# Altium schematic sheet Skema IO.SchDoc
size A4
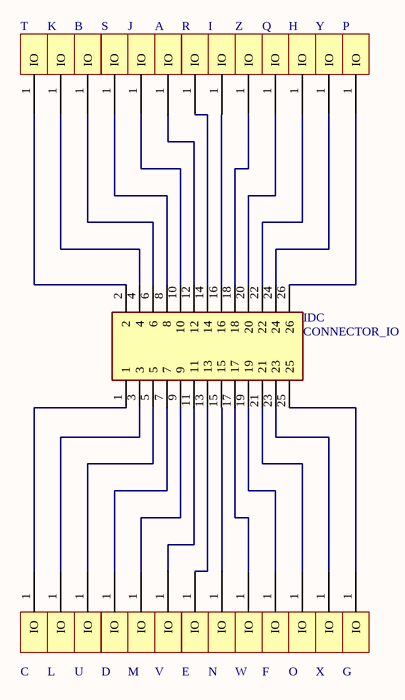
[diagram p0: Skema IO.SchDoc]

## Parts
A  Female_Connector_Banana  [F_Banana]  (value not drawn)
B  Female_Connector_Banana  [F_Banana]  (value not drawn)
C  Female_Connector_Banana  [F_Banana]  (value not drawn)
D  Female_Connector_Banana  [F_Banana]  (value not drawn)
E  Female_Connector_Banana  [F_Banana]  (value not drawn)
F  Female_Connector_Banana  [F_Banana]  (value not drawn)
G  Female_Connector_Banana  [F_Banana]  (value not drawn)
H  Female_Connector_Banana  [F_Banana]  (value not drawn)
I  Female_Connector_Banana  [F_Banana]  (value not drawn)
IDC  CONNECTOR_IO  [SHDRRA26W62P254_2X13_4023X957X920P]
J  Female_Connector_Banana  [F_Banana]  (value not drawn)
K  Female_Connector_Banana  [F_Banana]  (value not drawn)
L  Female_Connector_Banana  [F_Banana]  (value not drawn)
M  Female_Connector_Banana  [F_Banana]  (value not drawn)
N  Female_Connector_Banana  [F_Banana]  (value not drawn)
O  Female_Connector_Banana  [F_Banana]  (value not drawn)
P  Female_Connector_Banana  [F_Banana]  (value not drawn)
Q  Female_Connector_Banana  [F_Banana]  (value not drawn)
R  Female_Connector_Banana  [F_Banana]  (value not drawn)
S  Female_Connector_Banana  [F_Banana]  (value not drawn)
T  Female_Connector_Banana  [F_Banana]  (value not drawn)
U  Female_Connector_Banana  [F_Banana]  (value not drawn)
V  Female_Connector_Banana  [F_Banana]  (value not drawn)
W  Female_Connector_Banana  [F_Banana]  (value not drawn)
X  Female_Connector_Banana  [F_Banana]  (value not drawn)
Y  Female_Connector_Banana  [F_Banana]  (value not drawn)
Z  Female_Connector_Banana  [F_Banana]  (value not drawn)

## Nets
NetA_1: A.1(IO) IDC.12
NetB_1: B.1(IO) IDC.6
NetC_1: C.1(IO) IDC.1
NetD_1: D.1(IO) IDC.7
NetE_1: E.1(IO) IDC.13
NetF_1: F.1(IO) IDC.19
NetG_1: G.1(IO) IDC.25
NetH_1: H.1(IO) IDC.22
NetI_1: I.1(IO) IDC.16
NetIDC_2: IDC.2 T.1(IO)
NetIDC_3: IDC.3 L.1(IO)
NetIDC_4: IDC.4 K.1(IO)
NetIDC_5: IDC.5 U.1(IO)
NetIDC_8: IDC.8 S.1(IO)
NetIDC_9: IDC.9 M.1(IO)
NetIDC_10: IDC.10 J.1(IO)
NetIDC_11: IDC.11 V.1(IO)
NetIDC_14: IDC.14 R.1(IO)
NetIDC_15: IDC.15 N.1(IO)
NetIDC_17: IDC.17 W.1(IO)
NetIDC_18: IDC.18 Z.1(IO)
NetIDC_20: IDC.20 Q.1(IO)
NetIDC_21: IDC.21 O.1(IO)
NetIDC_23: IDC.23 X.1(IO)
NetIDC_24: IDC.24 Y.1(IO)
NetIDC_26: IDC.26 P.1(IO)

## Library data of the parts
IDC = CONNECTOR_IO: Connector; Manufacturer_Name: Amphenol; Manufacturer_Part_Number: 75867-105LF; Datasheet Link: https://cdn.amphenol-icc.com/media/wysiwyg/files/drawing/75867.pdf; Height: 9.2mm; Arrow Part Number: 75867-105LF; Arrow Price/Stock: https://www.arrow.com/en/products/75867-105lf/amphenol-fci; Mouser Part Number: 649-75867-105LF; Mouser Price/Stock: https://www.mouser.com/Search/Refine.aspx?Keyword=649-75867-105LF